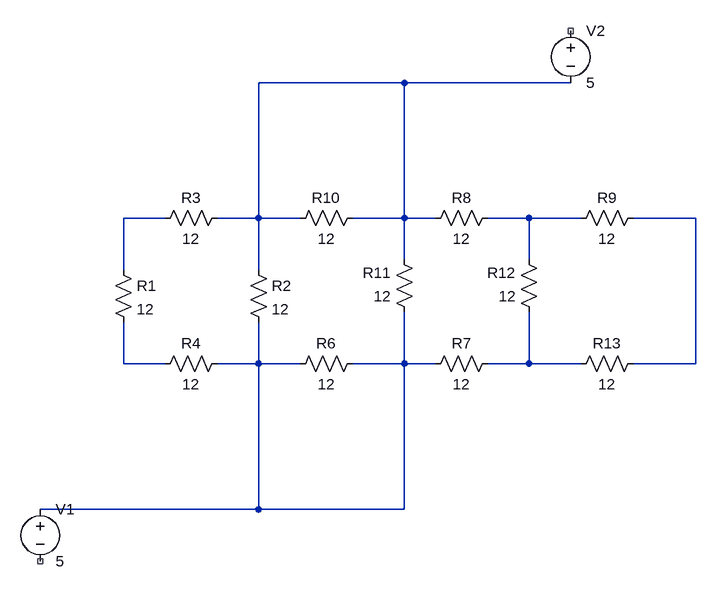
[diagram p0: schematic Draft1.asc]
Draft1.asc, the LTspice schematic file:
Version 4
SHEET 1 1140 736
WIRE 688 -16 464 -16
WIRE 944 -16 688 -16
WIRE 320 192 256 192
WIRE 464 192 464 -16
WIRE 464 192 400 192
WIRE 528 192 464 192
WIRE 688 192 688 -16
WIRE 688 192 608 192
WIRE 736 192 688 192
WIRE 880 192 816 192
WIRE 960 192 880 192
WIRE 1136 192 1040 192
WIRE 688 256 688 192
WIRE 880 256 880 192
WIRE 256 272 256 192
WIRE 464 272 464 192
WIRE 256 416 256 352
WIRE 320 416 256 416
WIRE 464 416 464 352
WIRE 464 416 400 416
WIRE 528 416 464 416
WIRE 688 416 688 336
WIRE 688 416 608 416
WIRE 736 416 688 416
WIRE 880 416 880 336
WIRE 880 416 816 416
WIRE 960 416 880 416
WIRE 1136 416 1136 192
WIRE 1136 416 1040 416
WIRE 464 640 464 416
WIRE 464 640 128 640
WIRE 688 640 688 416
WIRE 688 640 464 640
SYMBOL res 240 256 R0
SYMATTR InstName R1
SYMATTR Value 12
SYMBOL res 448 256 R0
SYMATTR InstName R2
SYMATTR Value 12
SYMBOL res 416 176 R90
WINDOW 0 0 56 VBottom 2
WINDOW 3 32 56 VTop 2
SYMATTR InstName R3
SYMATTR Value 12
SYMBOL res 416 400 R90
WINDOW 0 0 56 VBottom 2
WINDOW 3 32 56 VTop 2
SYMATTR InstName R4
SYMATTR Value 12
SYMBOL res 624 400 R90
WINDOW 0 0 56 VBottom 2
WINDOW 3 32 56 VTop 2
SYMATTR InstName R6
SYMATTR Value 12
SYMBOL res 832 400 R90
WINDOW 0 0 56 VBottom 2
WINDOW 3 32 56 VTop 2
SYMATTR InstName R7
SYMATTR Value 12
SYMBOL res 832 176 R90
WINDOW 0 0 56 VBottom 2
WINDOW 3 32 56 VTop 2
SYMATTR InstName R8
SYMATTR Value 12
SYMBOL res 1056 176 R90
WINDOW 0 0 56 VBottom 2
WINDOW 3 32 56 VTop 2
SYMATTR InstName R9
SYMATTR Value 12
SYMBOL res 624 176 R90
WINDOW 0 0 56 VBottom 2
WINDOW 3 32 56 VTop 2
SYMATTR InstName R10
SYMATTR Value 12
SYMBOL res 704 352 R180
WINDOW 0 36 76 Left 2
WINDOW 3 36 40 Left 2
SYMATTR InstName R11
SYMATTR Value 12
SYMBOL res 896 352 R180
WINDOW 0 36 76 Left 2
WINDOW 3 36 40 Left 2
SYMATTR InstName R12
SYMATTR Value 12
SYMBOL res 944 432 R270
WINDOW 0 32 56 VTop 2
WINDOW 3 0 56 VBottom 2
SYMATTR InstName R13
SYMATTR Value 12
SYMBOL voltage 128 624 R0
SYMATTR InstName V1
SYMATTR Value 5
SYMBOL voltage 944 -112 R0
SYMATTR InstName V2
SYMATTR Value 5

The netlist it stands for:
* Draft1.asc
R1 N002 N005 12
R2 N001 N006 12
R3 N001 N002 12
R4 N006 N005 12
R6 N006 N006 12
R7 N007 N006 12
R8 N003 N001 12
R9 N004 N003 12
R10 N001 N001 12
R11 N006 N001 12
R12 N007 N003 12
R13 N007 N004 12
V1 N006 NC_01 5
V2 NC_02 N001 5
.backanno
.end